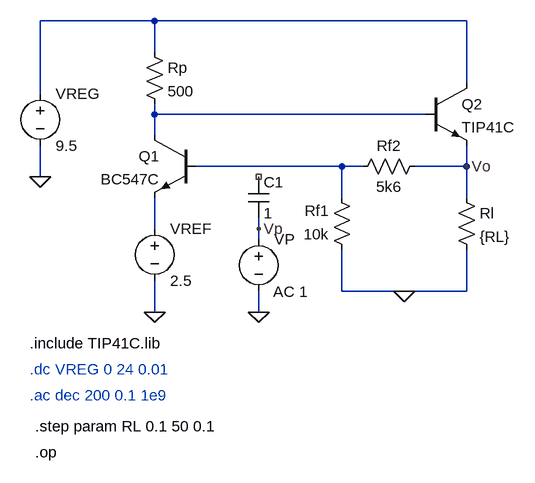
[diagram p0: schematic circuito_basico.asc]
circuito_basico.asc, the LTspice schematic file:
Version 4
SHEET 1 880 680
WIRE 256 -32 80 -32
WIRE 736 -32 256 -32
WIRE 256 16 256 -32
WIRE 736 64 736 -32
WIRE 80 80 80 -32
WIRE 256 112 256 96
WIRE 672 112 256 112
WIRE 256 144 256 112
WIRE 544 192 320 192
WIRE 576 192 544 192
WIRE 736 192 736 160
WIRE 736 192 656 192
WIRE 80 208 80 160
WIRE 544 240 544 192
WIRE 736 240 736 192
WIRE 256 288 256 240
WIRE 416 288 416 272
WIRE 416 304 416 288
WIRE 544 384 544 320
WIRE 640 384 544 384
WIRE 736 384 736 320
WIRE 736 384 640 384
WIRE 256 416 256 368
WIRE 416 416 416 384
FLAG 256 416 0
FLAG 640 384 0
FLAG 80 208 0
FLAG 736 192 Vo
FLAG 416 416 0
FLAG 416 288 Vp
SYMBOL voltage 80 64 R0
WINDOW 123 0 0 Left 0
WINDOW 39 0 0 Left 0
SYMATTR InstName VREG
SYMATTR Value 9.5
SYMBOL res 240 0 R0
SYMATTR InstName Rp
SYMATTR Value 500
SYMBOL npn 320 144 M0
SYMATTR InstName Q1
SYMATTR Value BC547C
SYMBOL voltage 256 272 R0
WINDOW 123 0 0 Left 0
WINDOW 39 0 0 Left 0
SYMATTR InstName VREF
SYMATTR Value 2.5
SYMBOL res 672 176 R90
WINDOW 0 0 56 VBottom 2
WINDOW 3 32 56 VTop 2
SYMATTR InstName Rf2
SYMATTR Value 5k6
SYMBOL res 560 336 R180
WINDOW 0 36 76 Left 2
WINDOW 3 36 40 Left 2
SYMATTR InstName Rf1
SYMATTR Value 10k
SYMBOL res 720 224 R0
SYMATTR InstName Rl
SYMATTR Value {RL}
SYMBOL npn 672 64 R0
SYMATTR InstName Q2
SYMATTR Value TIP41C
SYMBOL voltage 416 288 R0
WINDOW 123 22 97 Left 2
WINDOW 39 0 0 Left 0
SYMATTR InstName VP
SYMATTR Value ""
SYMATTR Value2 AC 1
SYMBOL cap 400 208 R0
SYMATTR InstName C1
SYMATTR Value 1
TEXT 64 464 Left 2 !.include TIP41C.lib
TEXT 64 504 Left 2 ;.dc VREG 0 24 0.01
TEXT 64 544 Left 2 ;.ac dec 200 0.1 1e9
TEXT 72 592 Left 2 !.step param RL 0.1 50 0.1
TEXT 72 632 Left 2 !.op

The netlist it stands for:
* circuito_basico.asc
VREG N001 0 9.5
Rp N001 N002 500
Q1 N002 N003 N004 0 BC547C
VREF N004 0 2.5
Rf2 Vo N003 5k6
Rf1 0 N003 10k
Rl Vo 0 {RL}
Q2 N001 N002 Vo 0 TIP41C
VP Vp 0 AC 1
C1 NC_01 Vp 1
.model NPN NPN
.model PNP PNP
.lib standard.bjt
.include TIP41C.lib
* .dc VREG 0 24 0.01
* .ac dec 200 0.1 1e9
.step param RL 0.1 50 0.1
.op
.backanno
.end